# EAGLE schematic Solenoid (EAGLE 9.1.3)
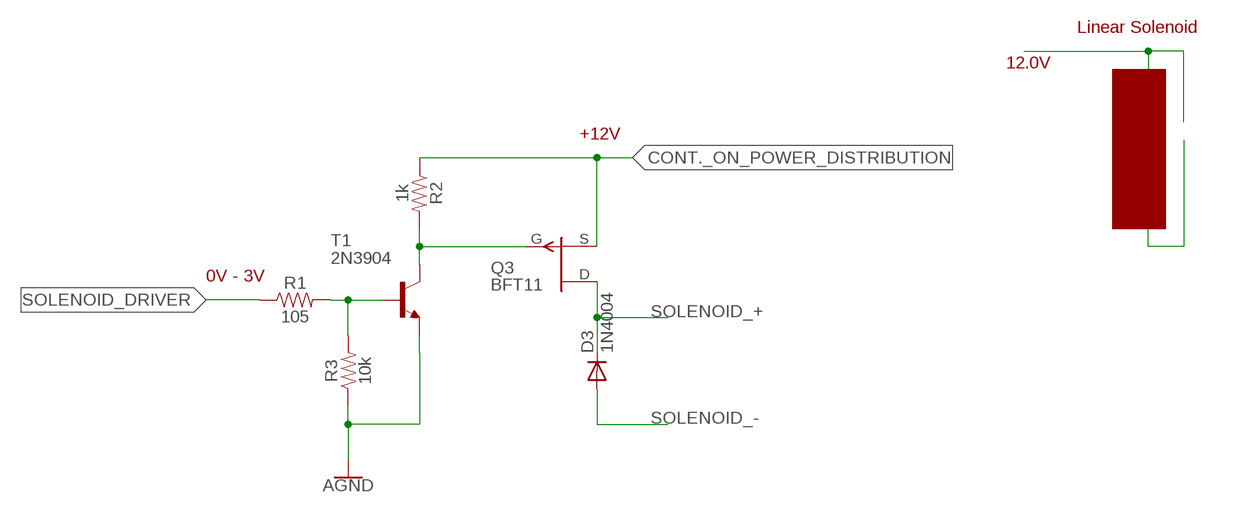
[diagram p0: schematic, sheet 1]

## Parts
D3  1N4004  [DO41-10]
Q3  BFT11  [TO92]
R1  105  105OHM-0603-1/10W-1%  [0603]
R2  1k  1KOHM-0603-1/10W-1%  [0603]
R3  10k  10KOHM-0603-1/10W-1%  [0603]
T1  2N3904  [TO92]

## Nets
AGND: R3.1 T1.3(E)
CONT._ON_POWER_DISTRIBUTION: Q3.2(S) R2.1
N$1: R1.2 R3.2 T1.2(B)
N$4: Q3.3(G) R2.2 T1.1(C)
SOLENOID_+: D3.C Q3.1(D)
SOLENOID_-: D3.A
SOLENOID_DRIVER: R1.1

## Notes on the sheet
- Linear Solenoid
- 12.0V
- +12V
- 0V - 3V

## Library data of the parts
D3 = diode:1N4004: DIODE general purpose rectifier, 1 A
Q3 = transistor-fet:BFT11: P-Channel Junction FET
R1 = SparkFun-Resistors:105OHM: 105Ω resistor A resistor is a passive two-terminal electrical component that implements electrical resistance as a circuit element. Resistors act to reduce current flow, and, at the same time, act to lower voltage levels within circuits. - Wikipedia; PROD_ID: RES-10751
R2 = SparkFun-Resistors:1KOHM: 1kΩ resistor A resistor is a passive two-terminal electrical component that implements electrical resistance as a circuit element. Resistors act to reduce current flow, and, at the same time, act to lower voltage levels within circuits. - Wikipedia; PROD_ID: RES-07856
R3 = SparkFun-Resistors:10KOHM: 10kΩ resistor A resistor is a passive two-terminal electrical component that implements electrical resistance as a circuit element. Resistors act to reduce current flow, and, at the same time, act to lower voltage levels within circuits. - Wikipedia; PROD_ID: RES-00824
T1 = transistor:2N3904: NPN TRANSISTOR